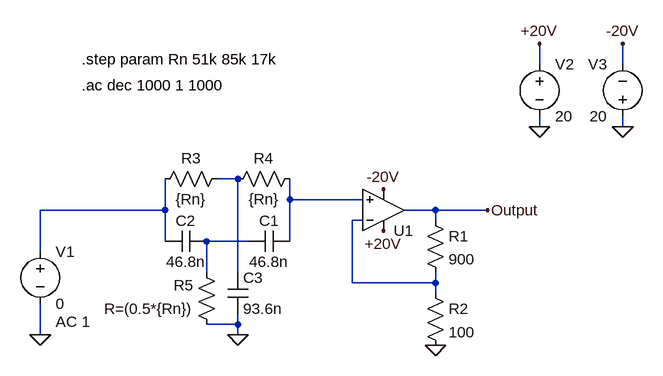
[diagram p0: schematic Draft3.asc]
Draft3.asc, the LTspice schematic file:
Version 4
SHEET 1 880 680
WIRE 464 -48 464 -80
WIRE 592 -48 592 -80
WIRE 464 48 464 32
WIRE 592 48 592 32
WIRE 0 128 -32 128
WIRE 80 160 80 128
WIRE 192 160 80 160
WIRE -112 176 -112 128
WIRE -112 176 -304 176
WIRE 304 176 256 176
WIRE 384 176 304 176
WIRE 192 192 176 192
WIRE 304 192 304 176
WIRE -112 224 -112 176
WIRE 16 224 -48 224
WIRE 80 224 80 160
WIRE -304 240 -304 176
WIRE -48 272 -48 224
WIRE 0 272 0 128
WIRE 176 288 176 192
WIRE 304 288 304 272
WIRE 304 288 176 288
WIRE 304 304 304 288
WIRE 0 352 0 336
WIRE 0 352 -48 352
WIRE -304 368 -304 320
WIRE 0 368 0 352
FLAG 304 384 0
FLAG -304 368 0
FLAG 464 48 0
FLAG 592 48 0
FLAG 464 -80 +20V
FLAG 592 -80 -20V
FLAG 224 208 +20V
FLAG 224 144 -20V
FLAG 384 176 Output
FLAG 0 368 0
SYMBOL Opamps\\UniversalOpamp2 224 176 M180
SYMATTR InstName U1
SYMBOL res 288 176 R0
SYMATTR InstName R1
SYMATTR Value 900
SYMBOL res 288 288 R0
SYMATTR InstName R2
SYMATTR Value 100
SYMBOL cap 80 208 R90
WINDOW 0 0 32 VBottom 2
WINDOW 3 32 32 VTop 2
SYMATTR InstName C1
SYMATTR Value 46.8n
SYMBOL cap -48 208 R90
WINDOW 0 0 32 VBottom 2
WINDOW 3 32 32 VTop 2
SYMATTR InstName C2
SYMATTR Value 46.8n
SYMBOL cap -16 272 R0
SYMATTR InstName C3
SYMATTR Value 93.6n
SYMBOL res -16 112 R90
WINDOW 0 0 56 VBottom 2
WINDOW 3 32 56 VTop 2
SYMATTR InstName R3
SYMATTR Value {Rn}
SYMBOL res 96 112 R90
WINDOW 0 0 56 VBottom 2
WINDOW 3 32 56 VTop 2
SYMATTR InstName R4
SYMATTR Value {Rn}
SYMBOL voltage -304 224 R0
WINDOW 123 24 124 Left 2
WINDOW 39 0 0 Left 2
SYMATTR Value2 AC 1
SYMATTR InstName V1
SYMATTR Value 0
SYMBOL voltage 464 -64 R0
WINDOW 123 0 0 Left 2
WINDOW 39 0 0 Left 2
SYMATTR InstName V2
SYMATTR Value 20
SYMBOL voltage 592 48 R180
WINDOW 0 24 96 Left 2
WINDOW 3 24 16 Left 2
WINDOW 123 0 0 Left 2
WINDOW 39 0 0 Left 2
SYMATTR InstName V3
SYMATTR Value 20
SYMBOL res -32 368 R180
WINDOW 0 36 76 Left 2
WINDOW 3 36 40 Left 2
SYMATTR InstName R5
SYMATTR Value R=(0.5*{Rn})
TEXT -240 -56 Left 2 !.step param Rn 51k 85k 17k
TEXT -240 -16 Left 2 !.ac dec 1000 1 1000

The netlist it stands for:
* Draft3.asc
XU1 N002 N004 +20V -20V Output level.2 Avol=1Meg GBW=10Meg Slew=10Meg ilimit=25m rail=0 Vos=0 phimargin=45 en=0 enk=0 in=0 ink=0 Rin=500Meg  ; pins IN+ IN- V+ V- OUT
R1 Output N004 900
R2 N004 0 100
C1 N002 N005 46.8n
C2 N005 N003 46.8n
C3 N001 0 93.6n
R3 N001 N003 {Rn}
R4 N002 N001 {Rn}
V1 N003 0 0 AC 1
V2 +20V 0 20
V3 0 -20V 20
R5 0 N005 R=(0.5*{Rn})
.step param Rn 51k 85k 17k
.ac dec 1000 1 1000
.lib UniversalOpamps2.sub
.backanno
.end